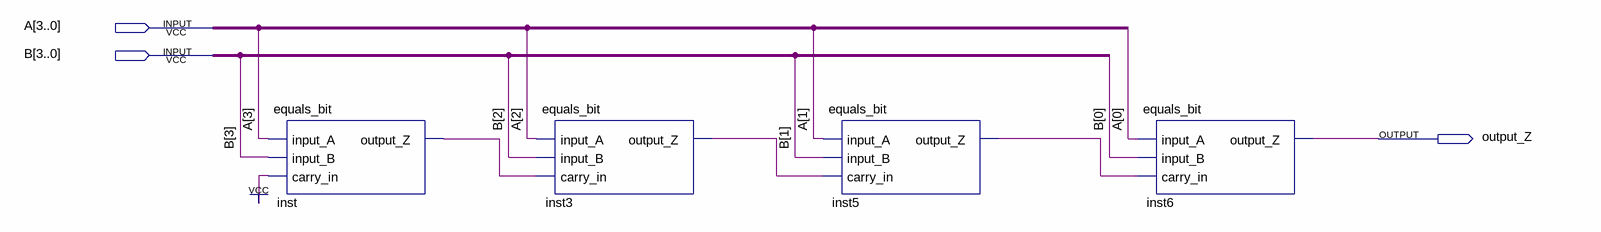
[diagram p0: schematic sheet]
// Quartus schematic compare_equals.bdf as structural Verilog: 4 symbols, 3 pins
module compare_equals (
  input  [3:0] A,
  input  [3:0] B,
  output output_Z
);

  wire inst3_output_z, inst5_output_z, inst_output_z;

  equals_bit inst (.input_A(A[3]), .input_B(B[3]), .carry_in(1'b1), .output_Z(inst_output_z));
  equals_bit inst3 (.input_A(A[2]), .input_B(B[2]), .carry_in(inst_output_z), .output_Z(inst3_output_z));
  equals_bit inst5 (.input_A(A[1]), .input_B(B[1]), .carry_in(inst3_output_z), .output_Z(inst5_output_z));
  equals_bit inst6 (.input_A(A[0]), .input_B(B[0]), .carry_in(inst5_output_z), .output_Z(output_Z));
endmodule
